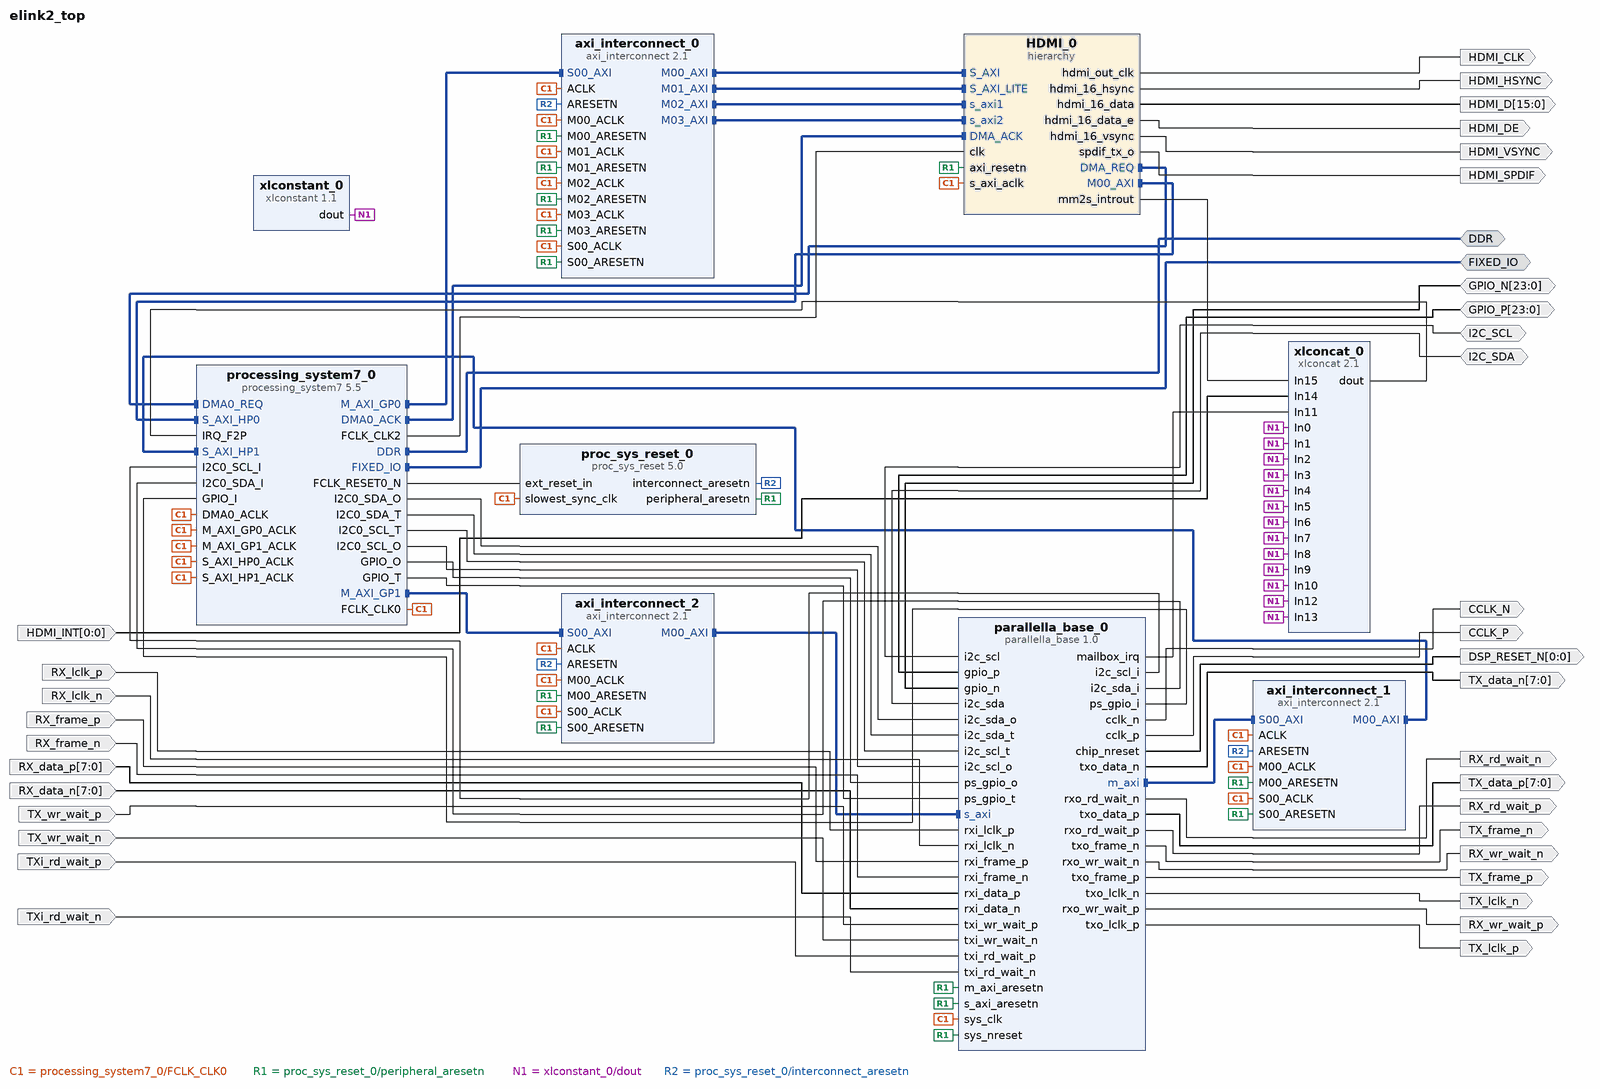
[diagram p0: block diagram of the top level]
# Vivado block design elink2_top, Vivado 2015.2.1
create_bd_design elink2_top

create_bd_intf_port -mode Master -vlnv xilinx.com:interface:ddrx_rtl:1.0 DDR
create_bd_intf_port -mode Master -vlnv xilinx.com:display_processing_system7:fixedio_rtl:1.0 FIXED_IO
create_bd_port -dir O -type clk HDMI_CLK
create_bd_port -dir O HDMI_HSYNC
create_bd_port -dir O HDMI_VSYNC
create_bd_port -dir O HDMI_DE
create_bd_port -dir O -from 15 -to 0 HDMI_D
create_bd_port -dir O HDMI_SPDIF
create_bd_port -dir I -from 0 -to 0 HDMI_INT
create_bd_port -dir IO I2C_SCL
create_bd_port -dir IO I2C_SDA
create_bd_port -dir IO -from 23 -to 0 GPIO_P
create_bd_port -dir IO -from 23 -to 0 GPIO_N
create_bd_port -dir O -from 7 -to 0 TX_data_n
create_bd_port -dir O -from 7 -to 0 TX_data_p
create_bd_port -dir O TX_frame_n
create_bd_port -dir O TX_frame_p
create_bd_port -dir O TX_lclk_n
create_bd_port -dir O TX_lclk_p
create_bd_port -dir O RX_rd_wait_n
create_bd_port -dir O RX_rd_wait_p
create_bd_port -dir O RX_wr_wait_n
create_bd_port -dir O RX_wr_wait_p
create_bd_port -dir I RX_lclk_p
create_bd_port -dir I RX_lclk_n
create_bd_port -dir I RX_frame_p
create_bd_port -dir I RX_frame_n
create_bd_port -dir I -from 7 -to 0 RX_data_p
create_bd_port -dir I -from 7 -to 0 RX_data_n
create_bd_port -dir I TX_wr_wait_p
create_bd_port -dir I TX_wr_wait_n
create_bd_port -dir I TXi_rd_wait_p
create_bd_port -dir I TXi_rd_wait_n
create_bd_port -dir O -from 0 -to 0 DSP_RESET_N
create_bd_port -dir O CCLK_P
create_bd_port -dir O CCLK_N

create_bd_cell -type ip -vlnv xilinx.com:ip:xlconcat:2.1 xlconcat_0
set_property -dict {CONFIG.NUM_PORTS 16} [get_bd_cells xlconcat_0]
create_bd_cell -type hier HDMI_0
create_bd_cell -type ip -vlnv xilinx.com:ip:xlconstant:1.1 xlconstant_0
set_property -dict {CONFIG.CONST_VAL 0} [get_bd_cells xlconstant_0]
create_bd_cell -type ip -vlnv xilinx.com:ip:axi_interconnect:2.1 axi_interconnect_0
set_property -dict {CONFIG.NUM_MI 4} [get_bd_cells axi_interconnect_0]
create_bd_cell -type ip -vlnv xilinx.com:ip:proc_sys_reset:5.0 proc_sys_reset_0
create_bd_cell -type ip -vlnv xilinx.com:ip:processing_system7:5.5 processing_system7_0
set_property -dict [list \
  CONFIG.PCW_UIPARAM_DDR_FREQ_MHZ 400 \
  CONFIG.PCW_SDIO_PERIPHERAL_FREQMHZ 50 \
  CONFIG.PCW_FPGA0_PERIPHERAL_FREQMHZ 100 \
  CONFIG.PCW_FPGA1_PERIPHERAL_FREQMHZ 152 \
  CONFIG.PCW_FPGA2_PERIPHERAL_FREQMHZ 200 \
  CONFIG.PCW_FPGA3_PERIPHERAL_FREQMHZ 100 \
  CONFIG.PCW_USE_M_AXI_GP1 1 \
  CONFIG.PCW_USE_S_AXI_HP0 1 \
  CONFIG.PCW_USE_S_AXI_HP1 1 \
  CONFIG.PCW_USE_DMA0 1 \
  CONFIG.PCW_USE_FABRIC_INTERRUPT 1 \
  CONFIG.PCW_EN_CLK2_PORT 1 \
  CONFIG.PCW_IRQ_F2P_INTR 1 \
  CONFIG.PCW_PRESET_BANK1_VOLTAGE {LVCMOS 1.8V} \
  CONFIG.PCW_UIPARAM_DDR_PARTNO Custom \
  CONFIG.PCW_QSPI_PERIPHERAL_ENABLE 1 \
  CONFIG.PCW_ENET0_PERIPHERAL_ENABLE 1 \
  CONFIG.PCW_ENET0_ENET0_IO {MIO 16 .. 27} \
  CONFIG.PCW_ENET0_GRP_MDIO_ENABLE 1 \
  CONFIG.PCW_SD1_PERIPHERAL_ENABLE 1 \
  CONFIG.PCW_SD1_SD1_IO {MIO 10 .. 15} \
  CONFIG.PCW_UART1_PERIPHERAL_ENABLE 1 \
  CONFIG.PCW_UART1_UART1_IO {MIO 8 .. 9} \
  CONFIG.PCW_USB0_PERIPHERAL_ENABLE 1 \
  CONFIG.PCW_USB1_PERIPHERAL_ENABLE 1 \
  CONFIG.PCW_I2C0_PERIPHERAL_ENABLE 1 \
  CONFIG.PCW_GPIO_MIO_GPIO_ENABLE 1 \
  CONFIG.PCW_GPIO_EMIO_GPIO_ENABLE 1 \
] [get_bd_cells processing_system7_0]
# 24 more settings of processing_system7_0 are not shown: defaults, MIO pin electricals, DDR timing, and values the tool derives
create_bd_cell -type ip -vlnv www.parallella.org:user:parallella_base:1.0 parallella_base_0
create_bd_cell -type ip -vlnv xilinx.com:ip:axi_interconnect:2.1 axi_interconnect_1
set_property -dict {CONFIG.NUM_SI 1 CONFIG.NUM_MI 1} [get_bd_cells axi_interconnect_1]
create_bd_cell -type ip -vlnv xilinx.com:ip:axi_interconnect:2.1 axi_interconnect_2
set_property -dict {CONFIG.NUM_MI 1} [get_bd_cells axi_interconnect_2]

# ---- hierarchy /HDMI_0 ----
current_bd_instance /HDMI_0
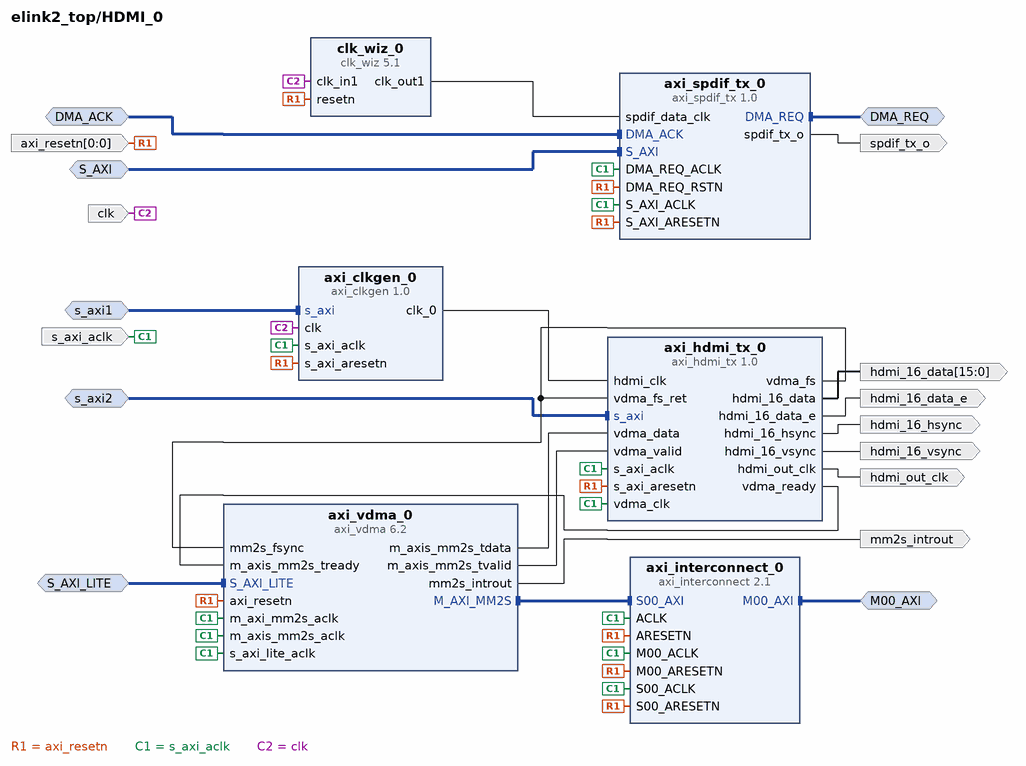
[diagram p1: block diagram inside /HDMI_0]
create_bd_intf_pin -mode Master -vlnv xilinx.com:interface:axis_rtl:1.0 DMA_REQ
create_bd_intf_pin -mode Master -vlnv xilinx.com:interface:aximm_rtl:1.0 M00_AXI
create_bd_intf_pin -mode Slave -vlnv xilinx.com:interface:axis_rtl:1.0 DMA_ACK
create_bd_intf_pin -mode Slave -vlnv xilinx.com:interface:aximm_rtl:1.0 S_AXI
create_bd_intf_pin -mode Slave -vlnv xilinx.com:interface:aximm_rtl:1.0 S_AXI_LITE
create_bd_intf_pin -mode Slave -vlnv xilinx.com:interface:aximm_rtl:1.0 s_axi1
create_bd_intf_pin -mode Slave -vlnv xilinx.com:interface:aximm_rtl:1.0 s_axi2
create_bd_pin -dir O -type clk hdmi_out_clk
create_bd_pin -dir O hdmi_16_hsync
create_bd_pin -dir O hdmi_16_vsync
create_bd_pin -dir O hdmi_16_data_e
create_bd_pin -dir O -from 15 -to 0 hdmi_16_data
create_bd_pin -dir O spdif_tx_o
create_bd_pin -dir O -type intr mm2s_introut
create_bd_pin -dir I -type clk s_axi_aclk
create_bd_pin -dir I -from 0 -to 0 -type rst axi_resetn
create_bd_pin -dir I clk

create_bd_cell -type ip -vlnv analog.com:user:axi_clkgen:1.0 axi_clkgen_0
create_bd_cell -type ip -vlnv analog.com:user:axi_hdmi_tx:1.0 axi_hdmi_tx_0
create_bd_cell -type ip -vlnv analog.com:user:axi_spdif_tx:1.0 axi_spdif_tx_0
set_property -dict {CONFIG.S_AXI_ADDRESS_WIDTH 16 CONFIG.DMA_TYPE 1} [get_bd_cells axi_spdif_tx_0]
create_bd_cell -type ip -vlnv xilinx.com:ip:clk_wiz:5.1 clk_wiz_0
set_property -dict [list \
  CONFIG.PRIM_IN_FREQ 200.000 \
  CONFIG.CLKIN1_JITTER_PS 50.0 \
  CONFIG.CLKOUT1_REQUESTED_OUT_FREQ 12.288 \
  CONFIG.USE_LOCKED false \
  CONFIG.RESET_PORT resetn \
  CONFIG.MMCM_DIVCLK_DIVIDE 9 \
  CONFIG.MMCM_CLKFBOUT_MULT_F 44.375 \
  CONFIG.MMCM_CLKIN1_PERIOD 5.0 \
  CONFIG.MMCM_CLKOUT0_DIVIDE_F 80.250 \
  CONFIG.RESET_TYPE ACTIVE_LOW \
  CONFIG.CLKOUT1_JITTER 327.996 \
  CONFIG.CLKOUT1_PHASE_ERROR 264.435 \
] [get_bd_cells clk_wiz_0]
create_bd_cell -type ip -vlnv xilinx.com:ip:axi_vdma:6.2 axi_vdma_0
set_property -dict [list \
  CONFIG.c_m_axis_mm2s_tdata_width 64 \
  CONFIG.c_use_mm2s_fsync 1 \
  CONFIG.c_include_s2mm 0 \
] [get_bd_cells axi_vdma_0]
create_bd_cell -type ip -vlnv xilinx.com:ip:axi_interconnect:2.1 axi_interconnect_0
set_property -dict {CONFIG.NUM_MI 1} [get_bd_cells axi_interconnect_0]

# ---- connections ----

current_bd_instance /HDMI_0
connect_bd_intf_net [get_bd_intf_pins axi_vdma_0/M_AXI_MM2S] [get_bd_intf_pins axi_interconnect_0/S00_AXI]
connect_bd_intf_net [get_bd_intf_pins DMA_REQ] [get_bd_intf_pins axi_spdif_tx_0/DMA_REQ]
connect_bd_intf_net [get_bd_intf_pins M00_AXI] [get_bd_intf_pins axi_interconnect_0/M00_AXI]
connect_bd_intf_net [get_bd_intf_pins DMA_ACK] [get_bd_intf_pins axi_spdif_tx_0/DMA_ACK]
connect_bd_intf_net [get_bd_intf_pins S_AXI] [get_bd_intf_pins axi_spdif_tx_0/S_AXI]
connect_bd_intf_net [get_bd_intf_pins S_AXI_LITE] [get_bd_intf_pins axi_vdma_0/S_AXI_LITE]
connect_bd_intf_net -intf_net s_axi1_1 [get_bd_intf_pins s_axi1] [get_bd_intf_pins axi_clkgen_0/s_axi]
connect_bd_intf_net -intf_net s_axi2_1 [get_bd_intf_pins s_axi2] [get_bd_intf_pins axi_hdmi_tx_0/s_axi]
connect_bd_net [get_bd_pins axi_spdif_tx_0/spdif_tx_o] [get_bd_pins spdif_tx_o]
connect_bd_net [get_bd_pins clk_wiz_0/clk_out1] [get_bd_pins axi_spdif_tx_0/spdif_data_clk]
connect_bd_net [get_bd_pins axi_vdma_0/mm2s_introut] [get_bd_pins mm2s_introut]
connect_bd_net [get_bd_pins axi_resetn] \
  [get_bd_pins axi_spdif_tx_0/S_AXI_ARESETN] [get_bd_pins axi_spdif_tx_0/DMA_REQ_RSTN] \
  [get_bd_pins axi_clkgen_0/s_axi_aresetn] [get_bd_pins axi_hdmi_tx_0/s_axi_aresetn] [get_bd_pins axi_vdma_0/axi_resetn] \
  [get_bd_pins clk_wiz_0/resetn] [get_bd_pins axi_interconnect_0/ARESETN] [get_bd_pins axi_interconnect_0/S00_ARESETN] \
  [get_bd_pins axi_interconnect_0/M00_ARESETN]
connect_bd_net [get_bd_pins axi_clkgen_0/clk_0] [get_bd_pins axi_hdmi_tx_0/hdmi_clk]
connect_bd_net [get_bd_pins s_axi_aclk] \
  [get_bd_pins axi_hdmi_tx_0/vdma_clk] [get_bd_pins axi_clkgen_0/s_axi_aclk] [get_bd_pins axi_hdmi_tx_0/s_axi_aclk] \
  [get_bd_pins axi_spdif_tx_0/S_AXI_ACLK] [get_bd_pins axi_spdif_tx_0/DMA_REQ_ACLK] [get_bd_pins axi_vdma_0/s_axi_lite_aclk] \
  [get_bd_pins axi_vdma_0/m_axi_mm2s_aclk] [get_bd_pins axi_vdma_0/m_axis_mm2s_aclk] [get_bd_pins axi_interconnect_0/ACLK] \
  [get_bd_pins axi_interconnect_0/S00_ACLK] [get_bd_pins axi_interconnect_0/M00_ACLK]
connect_bd_net [get_bd_pins clk] [get_bd_pins clk_wiz_0/clk_in1] [get_bd_pins axi_clkgen_0/clk]
connect_bd_net [get_bd_pins axi_hdmi_tx_0/vdma_fs] [get_bd_pins axi_vdma_0/mm2s_fsync] [get_bd_pins axi_hdmi_tx_0/vdma_fs_ret]
connect_bd_net [get_bd_pins axi_vdma_0/m_axis_mm2s_tdata] [get_bd_pins axi_hdmi_tx_0/vdma_data]
connect_bd_net [get_bd_pins axi_vdma_0/m_axis_mm2s_tvalid] [get_bd_pins axi_hdmi_tx_0/vdma_valid]
connect_bd_net [get_bd_pins axi_hdmi_tx_0/hdmi_out_clk] [get_bd_pins hdmi_out_clk]
connect_bd_net [get_bd_pins axi_hdmi_tx_0/hdmi_16_hsync] [get_bd_pins hdmi_16_hsync]
connect_bd_net [get_bd_pins axi_hdmi_tx_0/hdmi_16_vsync] [get_bd_pins hdmi_16_vsync]
connect_bd_net [get_bd_pins axi_hdmi_tx_0/hdmi_16_data_e] [get_bd_pins hdmi_16_data_e]
connect_bd_net [get_bd_pins axi_hdmi_tx_0/hdmi_16_data] [get_bd_pins hdmi_16_data]
connect_bd_net [get_bd_pins axi_hdmi_tx_0/vdma_ready] [get_bd_pins axi_vdma_0/m_axis_mm2s_tready]

current_bd_instance /
connect_bd_intf_net [get_bd_intf_pins processing_system7_0/DMA0_REQ] [get_bd_intf_pins HDMI_0/DMA_REQ]
connect_bd_intf_net [get_bd_intf_pins processing_system7_0/DMA0_ACK] [get_bd_intf_pins HDMI_0/DMA_ACK]
connect_bd_intf_net [get_bd_intf_pins processing_system7_0/S_AXI_HP0] [get_bd_intf_pins HDMI_0/M00_AXI]
connect_bd_intf_net [get_bd_intf_pins parallella_base_0/m_axi] [get_bd_intf_pins axi_interconnect_1/S00_AXI]
connect_bd_intf_net [get_bd_intf_pins axi_interconnect_1/M00_AXI] [get_bd_intf_pins processing_system7_0/S_AXI_HP1]
connect_bd_intf_net [get_bd_intf_pins processing_system7_0/M_AXI_GP0] [get_bd_intf_pins axi_interconnect_0/S00_AXI]
connect_bd_intf_net [get_bd_intf_pins processing_system7_0/M_AXI_GP1] [get_bd_intf_pins axi_interconnect_2/S00_AXI]
connect_bd_intf_net [get_bd_intf_pins parallella_base_0/s_axi] [get_bd_intf_pins axi_interconnect_2/M00_AXI]
connect_bd_intf_net [get_bd_intf_pins axi_interconnect_0/M00_AXI] [get_bd_intf_pins HDMI_0/S_AXI]
connect_bd_intf_net [get_bd_intf_pins axi_interconnect_0/M01_AXI] [get_bd_intf_pins HDMI_0/S_AXI_LITE]
connect_bd_intf_net [get_bd_intf_pins axi_interconnect_0/M02_AXI] [get_bd_intf_pins HDMI_0/s_axi1]
connect_bd_intf_net [get_bd_intf_pins axi_interconnect_0/M03_AXI] [get_bd_intf_pins HDMI_0/s_axi2]
connect_bd_intf_net [get_bd_intf_ports DDR] [get_bd_intf_pins processing_system7_0/DDR]
connect_bd_intf_net [get_bd_intf_ports FIXED_IO] [get_bd_intf_pins processing_system7_0/FIXED_IO]
connect_bd_net [get_bd_pins processing_system7_0/FCLK_CLK0] \
  [get_bd_pins proc_sys_reset_0/slowest_sync_clk] [get_bd_pins processing_system7_0/M_AXI_GP0_ACLK] \
  [get_bd_pins processing_system7_0/M_AXI_GP1_ACLK] [get_bd_pins processing_system7_0/S_AXI_HP0_ACLK] \
  [get_bd_pins processing_system7_0/S_AXI_HP1_ACLK] [get_bd_pins processing_system7_0/DMA0_ACLK] \
  [get_bd_pins parallella_base_0/sys_clk] [get_bd_pins HDMI_0/s_axi_aclk] [get_bd_pins axi_interconnect_0/ACLK] \
  [get_bd_pins axi_interconnect_0/S00_ACLK] [get_bd_pins axi_interconnect_0/M00_ACLK] \
  [get_bd_pins axi_interconnect_0/M01_ACLK] [get_bd_pins axi_interconnect_0/M02_ACLK] \
  [get_bd_pins axi_interconnect_0/M03_ACLK] [get_bd_pins axi_interconnect_1/ACLK] [get_bd_pins axi_interconnect_1/S00_ACLK] \
  [get_bd_pins axi_interconnect_1/M00_ACLK] [get_bd_pins axi_interconnect_2/ACLK] [get_bd_pins axi_interconnect_2/S00_ACLK] \
  [get_bd_pins axi_interconnect_2/M00_ACLK]
connect_bd_net [get_bd_pins processing_system7_0/FCLK_RESET0_N] [get_bd_pins proc_sys_reset_0/ext_reset_in]
connect_bd_net [get_bd_pins proc_sys_reset_0/peripheral_aresetn] \
  [get_bd_pins parallella_base_0/s_axi_aresetn] [get_bd_pins parallella_base_0/m_axi_aresetn] \
  [get_bd_pins parallella_base_0/sys_nreset] [get_bd_pins HDMI_0/axi_resetn] [get_bd_pins axi_interconnect_0/S00_ARESETN] \
  [get_bd_pins axi_interconnect_0/M00_ARESETN] [get_bd_pins axi_interconnect_0/M01_ARESETN] \
  [get_bd_pins axi_interconnect_0/M02_ARESETN] [get_bd_pins axi_interconnect_0/M03_ARESETN] \
  [get_bd_pins axi_interconnect_1/S00_ARESETN] [get_bd_pins axi_interconnect_1/M00_ARESETN] \
  [get_bd_pins axi_interconnect_2/S00_ARESETN] [get_bd_pins axi_interconnect_2/M00_ARESETN]
connect_bd_net [get_bd_pins HDMI_0/hdmi_out_clk] [get_bd_ports HDMI_CLK]
connect_bd_net [get_bd_pins HDMI_0/hdmi_16_hsync] [get_bd_ports HDMI_HSYNC]
connect_bd_net [get_bd_pins HDMI_0/hdmi_16_vsync] [get_bd_ports HDMI_VSYNC]
connect_bd_net [get_bd_pins HDMI_0/hdmi_16_data_e] [get_bd_ports HDMI_DE]
connect_bd_net [get_bd_pins HDMI_0/hdmi_16_data] [get_bd_ports HDMI_D]
connect_bd_net [get_bd_pins HDMI_0/spdif_tx_o] [get_bd_ports HDMI_SPDIF]
connect_bd_net [get_bd_pins HDMI_0/mm2s_introut] [get_bd_pins xlconcat_0/In15]
connect_bd_net [get_bd_pins xlconcat_0/dout] [get_bd_pins processing_system7_0/IRQ_F2P]
connect_bd_net -net In14_1 [get_bd_ports HDMI_INT] [get_bd_pins xlconcat_0/In14]
connect_bd_net [get_bd_pins processing_system7_0/FCLK_CLK2] [get_bd_pins HDMI_0/clk]
connect_bd_net [get_bd_pins xlconstant_0/dout] \
  [get_bd_pins xlconcat_0/In0] [get_bd_pins xlconcat_0/In1] [get_bd_pins xlconcat_0/In2] [get_bd_pins xlconcat_0/In3] \
  [get_bd_pins xlconcat_0/In4] [get_bd_pins xlconcat_0/In5] [get_bd_pins xlconcat_0/In6] [get_bd_pins xlconcat_0/In7] \
  [get_bd_pins xlconcat_0/In8] [get_bd_pins xlconcat_0/In9] [get_bd_pins xlconcat_0/In10] [get_bd_pins xlconcat_0/In12] \
  [get_bd_pins xlconcat_0/In13]
connect_bd_net [get_bd_ports I2C_SCL] [get_bd_pins parallella_base_0/i2c_scl]
connect_bd_net [get_bd_ports I2C_SDA] [get_bd_pins parallella_base_0/i2c_sda]
connect_bd_net [get_bd_ports GPIO_P] [get_bd_pins parallella_base_0/gpio_p]
connect_bd_net [get_bd_ports GPIO_N] [get_bd_pins parallella_base_0/gpio_n]
connect_bd_net [get_bd_pins processing_system7_0/I2C0_SDA_O] [get_bd_pins parallella_base_0/i2c_sda_o]
connect_bd_net [get_bd_pins processing_system7_0/I2C0_SDA_T] [get_bd_pins parallella_base_0/i2c_sda_t]
connect_bd_net [get_bd_pins processing_system7_0/I2C0_SCL_T] [get_bd_pins parallella_base_0/i2c_scl_t]
connect_bd_net [get_bd_pins processing_system7_0/I2C0_SCL_O] [get_bd_pins parallella_base_0/i2c_scl_o]
connect_bd_net [get_bd_pins parallella_base_0/i2c_scl_i] [get_bd_pins processing_system7_0/I2C0_SCL_I]
connect_bd_net [get_bd_pins parallella_base_0/i2c_sda_i] [get_bd_pins processing_system7_0/I2C0_SDA_I]
connect_bd_net [get_bd_pins parallella_base_0/ps_gpio_i] [get_bd_pins processing_system7_0/GPIO_I]
connect_bd_net [get_bd_pins processing_system7_0/GPIO_O] [get_bd_pins parallella_base_0/ps_gpio_o]
connect_bd_net [get_bd_pins processing_system7_0/GPIO_T] [get_bd_pins parallella_base_0/ps_gpio_t]
connect_bd_net -net parallella_base_0_mailbox_not_empty [get_bd_pins parallella_base_0/mailbox_irq] [get_bd_pins xlconcat_0/In11]
connect_bd_net [get_bd_pins parallella_base_0/txo_data_n] [get_bd_ports TX_data_n]
connect_bd_net [get_bd_pins parallella_base_0/txo_data_p] [get_bd_ports TX_data_p]
connect_bd_net [get_bd_pins parallella_base_0/txo_frame_n] [get_bd_ports TX_frame_n]
connect_bd_net [get_bd_pins parallella_base_0/txo_frame_p] [get_bd_ports TX_frame_p]
connect_bd_net [get_bd_pins parallella_base_0/txo_lclk_n] [get_bd_ports TX_lclk_n]
connect_bd_net [get_bd_pins parallella_base_0/txo_lclk_p] [get_bd_ports TX_lclk_p]
connect_bd_net [get_bd_pins parallella_base_0/rxo_rd_wait_n] [get_bd_ports RX_rd_wait_n]
connect_bd_net [get_bd_pins parallella_base_0/rxo_rd_wait_p] [get_bd_ports RX_rd_wait_p]
connect_bd_net [get_bd_pins parallella_base_0/rxo_wr_wait_n] [get_bd_ports RX_wr_wait_n]
connect_bd_net [get_bd_pins parallella_base_0/rxo_wr_wait_p] [get_bd_ports RX_wr_wait_p]
connect_bd_net -net rxi_lclk_p_1 [get_bd_ports RX_lclk_p] [get_bd_pins parallella_base_0/rxi_lclk_p]
connect_bd_net -net rxi_lclk_n_1 [get_bd_ports RX_lclk_n] [get_bd_pins parallella_base_0/rxi_lclk_n]
connect_bd_net -net rxi_frame_p_1 [get_bd_ports RX_frame_p] [get_bd_pins parallella_base_0/rxi_frame_p]
connect_bd_net -net rxi_frame_n_1 [get_bd_ports RX_frame_n] [get_bd_pins parallella_base_0/rxi_frame_n]
connect_bd_net -net rxi_data_p_1 [get_bd_ports RX_data_p] [get_bd_pins parallella_base_0/rxi_data_p]
connect_bd_net -net rxi_data_n_1 [get_bd_ports RX_data_n] [get_bd_pins parallella_base_0/rxi_data_n]
connect_bd_net -net txi_wr_wait_p_1 [get_bd_ports TX_wr_wait_p] [get_bd_pins parallella_base_0/txi_wr_wait_p]
connect_bd_net -net txi_wr_wait_n_1 [get_bd_ports TX_wr_wait_n] [get_bd_pins parallella_base_0/txi_wr_wait_n]
connect_bd_net [get_bd_ports TXi_rd_wait_p] [get_bd_pins parallella_base_0/txi_rd_wait_p]
connect_bd_net [get_bd_ports TXi_rd_wait_n] [get_bd_pins parallella_base_0/txi_rd_wait_n]
connect_bd_net [get_bd_pins parallella_base_0/chip_nreset] [get_bd_ports DSP_RESET_N]
connect_bd_net [get_bd_pins parallella_base_0/cclk_p] [get_bd_ports CCLK_P]
connect_bd_net [get_bd_pins parallella_base_0/cclk_n] [get_bd_ports CCLK_N]
connect_bd_net [get_bd_pins proc_sys_reset_0/interconnect_aresetn] \
  [get_bd_pins axi_interconnect_0/ARESETN] [get_bd_pins axi_interconnect_1/ARESETN] [get_bd_pins axi_interconnect_2/ARESETN]

# ---- address map ----
assign_bd_address -offset 0x00000000 -range 1G -target_address_space [get_bd_addr_spaces HDMI_0/axi_vdma_0/Data_MM2S] [get_bd_addr_segs processing_system7_0/S_AXI_HP0/HP0_DDR_LOWOCM]
assign_bd_address -offset 0x00000000 -range 1G -target_address_space [get_bd_addr_spaces parallella_base_0/m_axi] [get_bd_addr_segs processing_system7_0/S_AXI_HP1/HP1_DDR_LOWOCM]
assign_bd_address -offset 0x43000000 -range 64K -target_address_space [get_bd_addr_spaces processing_system7_0/Data] [get_bd_addr_segs HDMI_0/axi_vdma_0/S_AXI_LITE/Reg]
assign_bd_address -offset 0x66000000 -range 64K -target_address_space [get_bd_addr_spaces processing_system7_0/Data] [get_bd_addr_segs HDMI_0/axi_clkgen_0/s_axi/axi_lite]
assign_bd_address -offset 0x6C000000 -range 64K -target_address_space [get_bd_addr_spaces processing_system7_0/Data] [get_bd_addr_segs HDMI_0/axi_hdmi_tx_0/s_axi/axi_lite]
assign_bd_address -offset 0x75C00000 -range 64K -target_address_space [get_bd_addr_spaces processing_system7_0/Data] [get_bd_addr_segs HDMI_0/axi_spdif_tx_0/S_AXI/reg0]
assign_bd_address -offset 0x80000000 -range 1G -target_address_space [get_bd_addr_spaces processing_system7_0/Data] [get_bd_addr_segs parallella_base_0/s_axi/axi_lite]

validate_bd_design
save_bd_design
